# Altium schematic sheet Headers.SchDoc: Name project title here
size 297 x 209 mm; Organization: Krakul OÜ; Address1: Kaare tee 3, lubja; Address2: viimsi vald; Address3: harju maakond; Address4: Estonia 74010; DocumentNumber: No here; Revision: 0; SheetNumber: 5; SheetTotal: 5
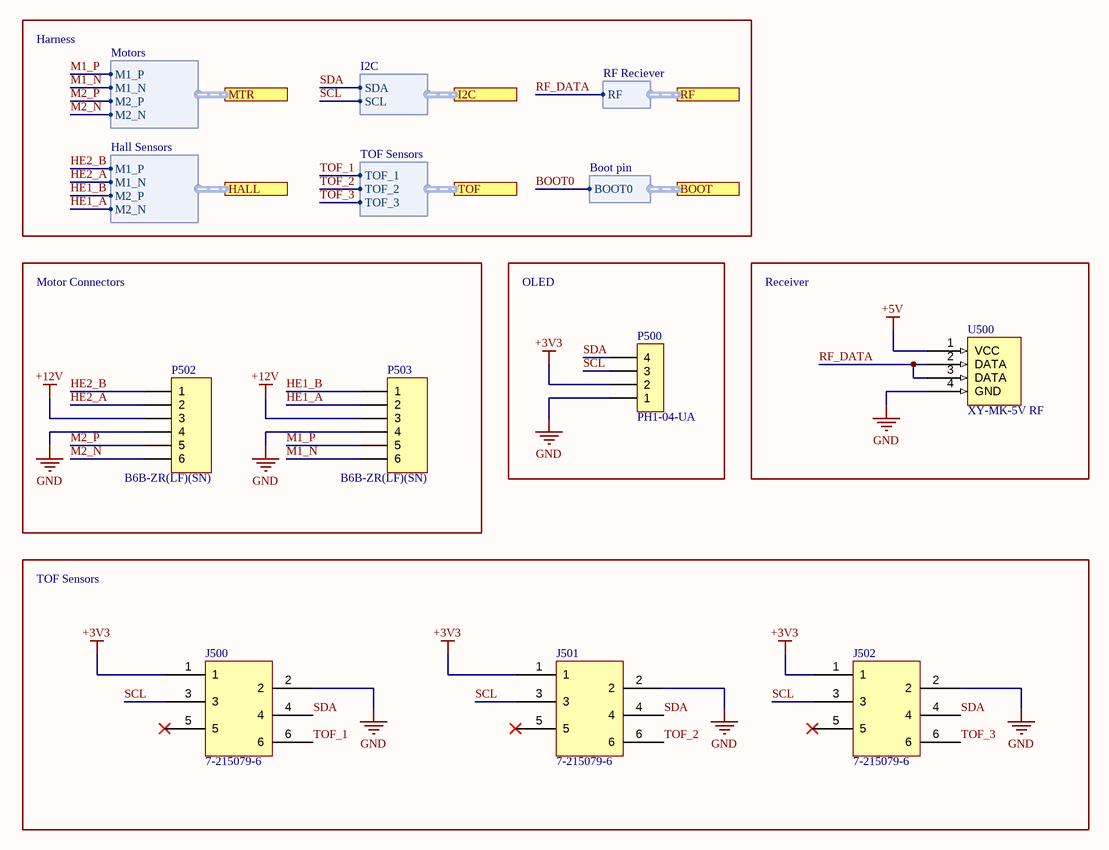
[diagram p0: Headers.SchDoc]

## Parts
J500  7-215079-6  [7-215079-6-Footprint-1]
J501  7-215079-6  [7-215079-6-Footprint-1]
J502  7-215079-6  [7-215079-6-Footprint-1]
P500  PH1-04-UA  [4Pos Pin Header Vertical]
P502  B6B-ZR(LF)(SN)  [FP-B6B-ZR-SM4-TF_LF_SN-MFG]
P503  B6B-ZR(LF)(SN)  [FP-B6B-ZR-SM4-TF_LF_SN-MFG]
U500  XY-MK-5V RF  [2.54mm 4 POS XY-MK-5V RF]

## Blocks framed on the sheet
Motor Connectors: P502 P503
OLED: P500
Receiver: U500
TOF Sensors: J500-J502

## Ports
BOOT (harness Boot pin, see Overview[3C], MCU_USB[2A]), HALL (harness Hall Sensors, see Overview[3C], MCU_USB[2B]), I2C (harness I2C, see Overview[3C], MCU_USB[2B]), MTR (harness Motors, see Overview[3B], Driver[6A]), RF (harness RF Reciever, see Overview[3C], MCU_USB[2B]), TOF (harness TOF Sensors, see Overview[3C], MCU_USB[2B])

## Harnesses
Motors: M1_P, M1_N, M2_P, M2_N
Hall Sensors: M1_P, M1_N, M2_P, M2_N
I2C: SDA, SCL
TOF Sensors: TOF_1, TOF_2, TOF_3
RF Reciever: RF
Boot pin: BOOT0

## Nets
+3V3: J500.1 J501.1 J502.1 P500.2
+5V: U500.1(VCC)
+12V: P502.3 P503.3
GND: J500.2 J501.2 J502.2 P500.1 P502.4 P503.4 U500.4(GND)
BOOT0: port BOOT.BOOT0
HE1_A: P503.2 ; port HALL.M2_N
HE1_B: P503.1 ; port HALL.M2_P
HE2_A: P502.2 ; port HALL.M1_N
HE2_B: P502.1 ; port HALL.M1_P
M1_N: P503.6 ; port MTR.M1_N
M1_P: P503.5 ; port MTR.M1_P
M2_N: P502.6 ; port MTR.M2_N
M2_P: P502.5 ; port MTR.M2_P
RF_DATA: U500.2(DATA) U500.3(DATA) ; port RF.RF
SCL: J500.3 J501.3 J502.3 P500.3 ; port I2C.SCL
SDA: J500.4 J501.4 J502.4 P500.4 ; port I2C.SDA
TOF_1: J500.6 ; port TOF.TOF_1
TOF_2: J501.6 ; port TOF.TOF_2
TOF_3: J502.6 ; port TOF.TOF_3

Not connected (* = marked no-connect by the designer): J500 5*; J501 5*; J502 5*

## Notes on the sheet
- Harness
- Title:
- Date:
- Last modified:
- Project:
- Sheet
- Time:
- of
- Size:
- A3
- Engineer:
- Revision:
- Revision date:
- Checked by:

## Library data of the parts
J500-J502 = CMP-ROOT-01311-2: Conn FFC Connector F 6 POS 1.27mm Solder ST Thru-Hole Automotive Box/Carton; Manufacturer: TE Connectivity; Manufacturer Lifecycle Status: ACTIVE; Contact Current Rating: 1A; Contact Resistance: 10mΩ; Insulation Resistance: 1GΩ; Mating Connector Lock: Without; Number of Contacts: 6; Number of Ports: 1; Operating Force: 4.8928N; Operating Supply Voltage: 100V; PCB Mount Retention: With; Plating Thickness: 4.99999µm; Row Spacing: 2.54mm; Shielding: No; Mount: TH; Part number: 7-215079-6; Pins: 6; RoHS: Compliant; China RoHS: Compliant; Color: Red; Contact Gender: Female; Contact Material: Nickel, Tin; Contact Plating: Tin; Current Rating: 1A; Height: 4.2mm; Housing Color: Red; Insulation Material: Thermoplastic; Lead Free: Lead Free; Lead Pitch: 1.27mm; Length: 9.7mm; Lifecycle Status: Production; Max Operating Temperature: 105°C; Min Operating Temperature: -40°C; Mounting Technology: Through Hole; Number of Positions: 6; Number of Rows: 2; Orientation: Vertical; Packaging: Box; REACH SVHC: Yes; Terminal Pitch: 1.27mm; Voltage Rating: 100V; Voltage Rating (DC): 100V
P500 = CMP-002-000004-1: 4 POS 2.54mm Vertical THT Header; Manufacturer: Adam Tech; Number of Positions: 4; Pins: 4; RoHS: Yes; Part number: PH1-04-UA; Mount: TH; Lead Free: Lead Free; Pitch: 2.54mm; Termination: Through Hole
P502 P503 = CMP-ROOT-01270-2: Header for PCB; pitch 1.50mm; 6-contacts; THT; male; top entry; 50V/1A; Manufacturer: JST Sales America Inc.; Body Plating: Tin; Connector Type: Male Pin; Contact Resistance: 30mΩ; Current Rating: 1A; Insulation Resistance: 500MΩ; Max Voltage Rating (AC): 50V; Number of Contacts: 6; Panel Thickness: 3.5mm; Pitch: 1.5mm; Mount: TH; Part number: B6B-ZR; Pins: 6; RoHS: Compliant; China RoHS: Compliant; Color: Natural, White; Contact Gender: Male; Contact Material: Copper, Tin; Contact Mating Length: 2.3876mm; Contact Plating: Tin; Depth: 3.5mm; Fastening Type: Detent; Flammability Rating: UL94 V-0; Gender: Male; Height: 4.5mm; Housing Material: Polyamide; Lead Free: Lead Free; Lead Pitch: 1.5mm; Length: 3.048mm; Lifecycle Status: Production; Material: Nylon; Max Current Rating: 1A; Max Operating Temperature: 85°C; Min Operating Temperature: -25°C; Mounting Technology: Through Hole; Number of Positions: 6; Number of Rows: 1; Orientation: Straight; Packaging: Bulk; REACH SVHC: Yes; Terminal Pitch: 1.5mm; Termination: Solder; Voltage Rating: 50V; Voltage Rating (AC): 50V; Voltage Rating (DC): 50V; Weight: 28.349523g; Width: 5.08mm
U500 = CMP-00015-1: 433MHz reciever module, 5V tolerant; Manufacturer: Unknown; Case/Package: 2.54mm 4 POS; Mount: THT; Part number: XY-MK-5V RF; RoHS: Yes